# EAGLE design Adafruit Speaker Bonnet rev C (EAGLE 6.4)
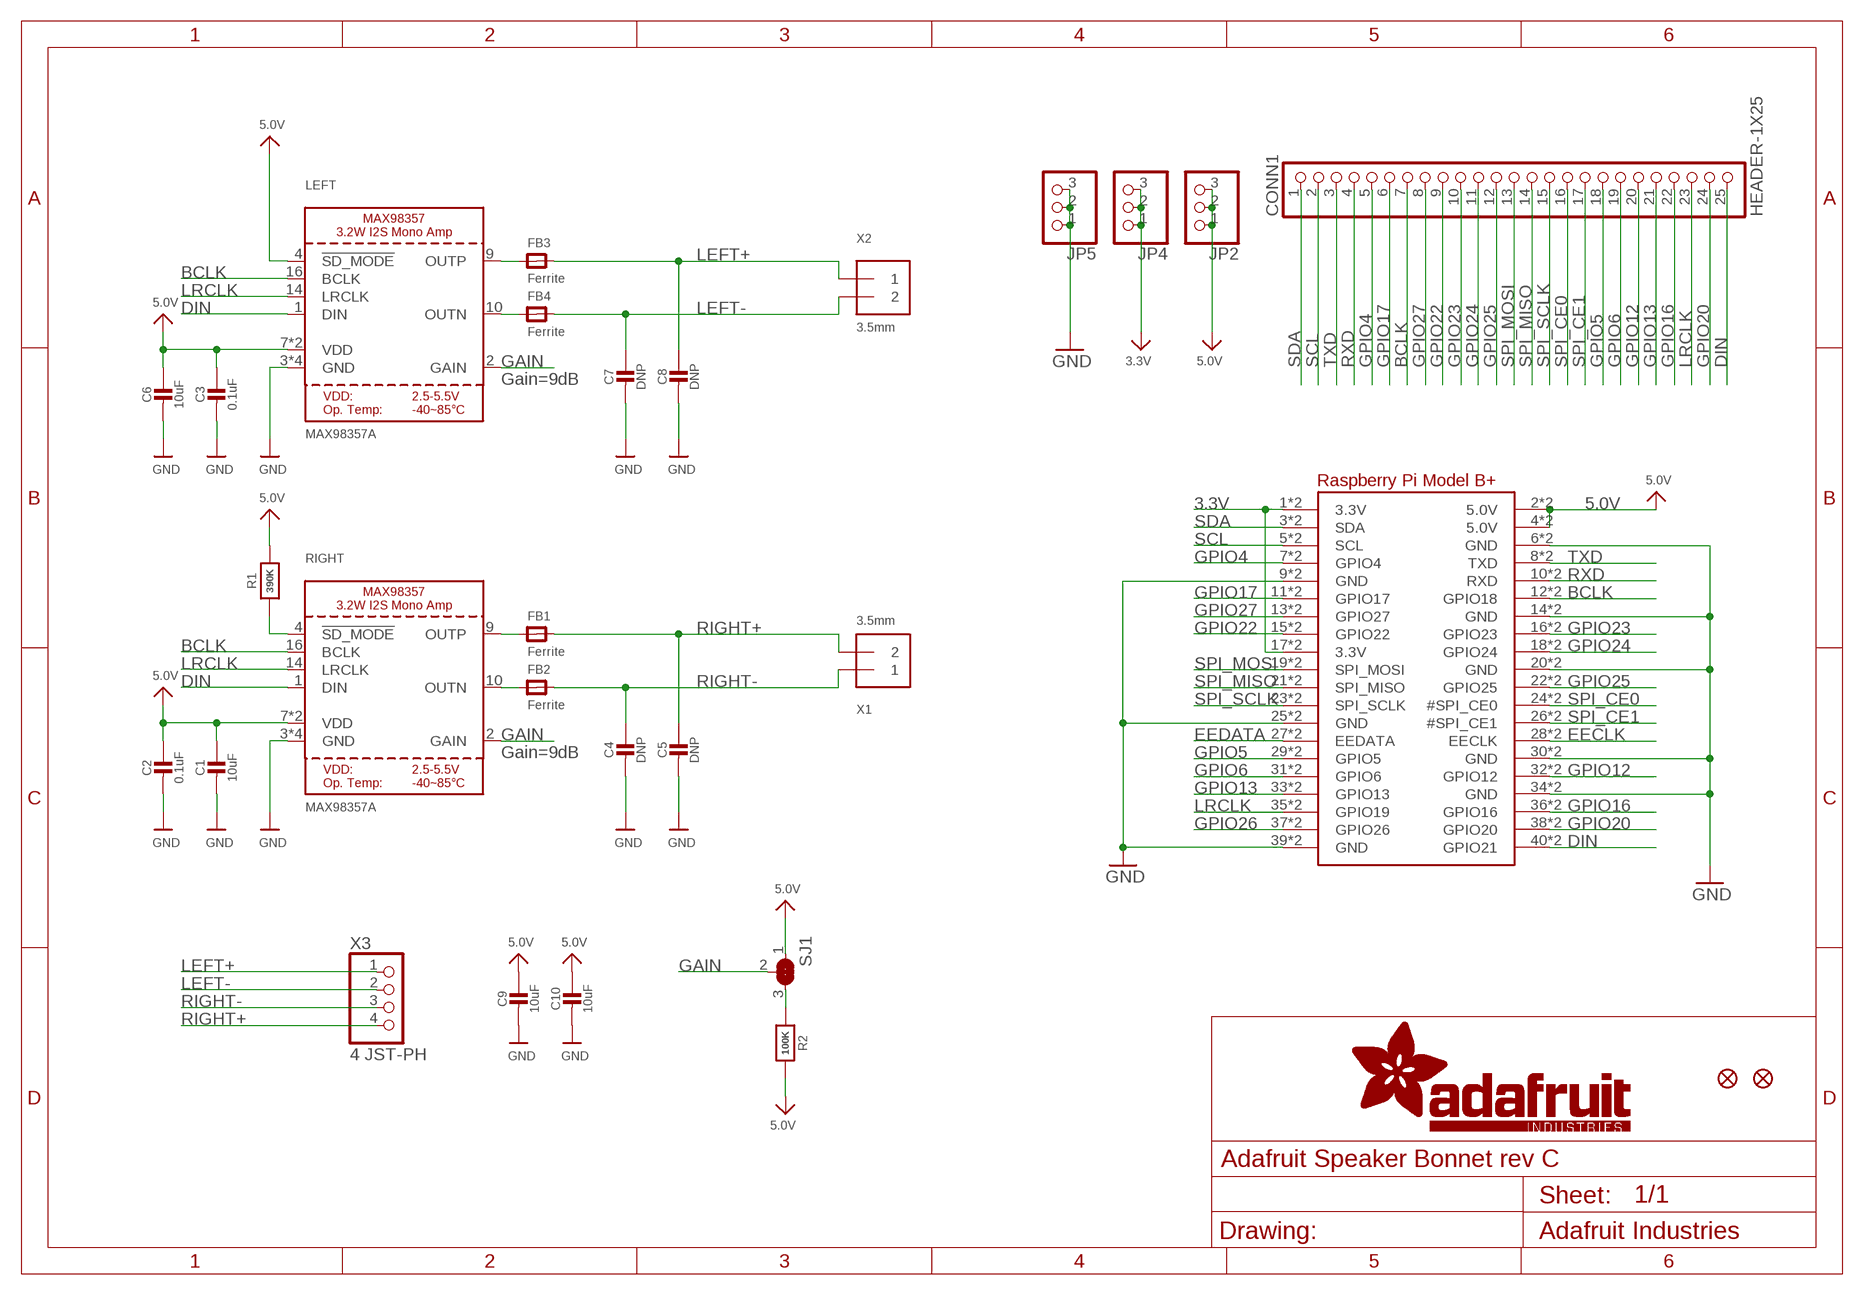
[diagram p0: schematic, sheet 1]

## Parts
C1  10uF  CAP_CERAMIC0805-NOOUTLINE  [0805-NO]
C2  0.1uF  CAP_CERAMIC0805-NOOUTLINE  [0805-NO]
C3  0.1uF  CAP_CERAMIC0805-NOOUTLINE  [0805-NO]
C4  DNP  CAP_CERAMIC0805-NOOUTLINE  [0805-NO]
C5  DNP  CAP_CERAMIC0805-NOOUTLINE  [0805-NO]
C6  10uF  CAP_CERAMIC0805-NOOUTLINE  [0805-NO]
C7  DNP  CAP_CERAMIC0805-NOOUTLINE  [0805-NO]
C8  DNP  CAP_CERAMIC0805-NOOUTLINE  [0805-NO]
C9  10uF  CAP_CERAMIC0805-NOOUTLINE  [0805-NO]
C10  10uF  CAP_CERAMIC0805-NOOUTLINE  [0805-NO]
CONN1  HEADER-1X25  [1X25_ROUND_70MIL]
FB1  Ferrite  FERRITE-0805NO  [0805-NO]
FB2  Ferrite  FERRITE-0805NO  [0805-NO]
FB3  Ferrite  FERRITE-0805NO  [0805-NO]
FB4  Ferrite  FERRITE-0805NO  [0805-NO]
FID1  FIDUCIAL_1MM  [FIDUCIAL_1MM]
FID2  FIDUCIAL_1MM  [FIDUCIAL_1MM]
JP2  HEADER-1X376MIL  [1X03_ROUND_76]
JP4  HEADER-1X376MIL  [1X03_ROUND_76]
JP5  HEADER-1X376MIL  [1X03_ROUND_76]
LEFT  MAX98357A  AUDIOAMP_MAX98357  [QFN16_3MM]
R1  390K  RESISTOR0805_NOOUTLINE  [0805-NO]
R2  100K  RESISTOR0805_NOOUTLINE  [0805-NO]
RIGHT  MAX98357A  AUDIOAMP_MAX98357  [QFN16_3MM]
RPI1  RASPBERRYPI_BPLUS_BONNET_THMSMT  [PI_BONNET_THMSMT]
SJ1  SOLDERJUMPER_2WAY  [SOLDERJUMPER_2WAY_OPEN_NOPASTE]
X1  3.5mm  TERMBLOCK_1X2  [TERMBLOCK_1X2-3.5MM]
X2  3.5mm  TERMBLOCK_1X2  [TERMBLOCK_1X2-3.5MM]
X3  4 JST-PH  CON_JST_PH_4PIN  [JSTPH4]

## Nets
3.3V: JP4.1 JP4.2 JP4.3 RPI1.1(3.3V) RPI1.17(3.3V) RPI1.S1(3.3V) RPI1.S17(3.3V)
5.0V: C1.1 C2.1 C3.1 C6.1 C9.1 C10.1 JP2.1 JP2.2 JP2.3 LEFT.4(!SD_MODE) LEFT.7(VDD) LEFT.8(VDD) R1.2 R2.2 RIGHT.7(VDD) RIGHT.8(VDD) RPI1.2(5.0V) RPI1.4(5.0V) RPI1.S2(5.0V) RPI1.S4(5.0V) SJ1.1
BCLK: CONN1.7 LEFT.16(BCLK) RIGHT.16(BCLK) RPI1.12(GPIO18) RPI1.S12(GPIO18)
DIN: CONN1.25 LEFT.1(DIN) RIGHT.1(DIN) RPI1.40(GPIO21) RPI1.S40(GPIO21)
EECLK: RPI1.28(EECLK) RPI1.S28(EECLK)
EEDATA: RPI1.27(EEDATA) RPI1.S27(EEDATA)
GAIN: LEFT.2(GAIN) RIGHT.2(GAIN) SJ1.2
GND: C1.2 C2.2 C3.2 C4.2 C5.2 C6.2 C7.2 C8.2 C9.2 C10.2 JP5.1 JP5.2 JP5.3 LEFT.3(GND) LEFT.11(GND) LEFT.15(GND) LEFT.THERMAL(GND) RIGHT.3(GND) RIGHT.11(GND) RIGHT.15(GND) RIGHT.THERMAL(GND) RPI1.6(GND) RPI1.9(GND) RPI1.14(GND) RPI1.20(GND) RPI1.25(GND) RPI1.30(GND) RPI1.34(GND) RPI1.39(GND) RPI1.S6(GND) RPI1.S9(GND) RPI1.S14(GND) RPI1.S20(GND) RPI1.S25(GND) RPI1.S30(GND) RPI1.S34(GND) RPI1.S39(GND)
GPIO4: CONN1.5 RPI1.7(GPIO4) RPI1.S7(GPIO4)
GPIO5: CONN1.18 RPI1.29(GPIO5) RPI1.S29(GPIO5)
GPIO6: CONN1.19 RPI1.31(GPIO6) RPI1.S31(GPIO6)
GPIO12: CONN1.20 RPI1.32(GPIO12) RPI1.S32(GPIO12)
GPIO13: CONN1.21 RPI1.33(GPIO13) RPI1.S33(GPIO13)
GPIO16: CONN1.22 RPI1.36(GPIO16) RPI1.S36(GPIO16)
GPIO17: CONN1.6 RPI1.11(GPIO17) RPI1.S11(GPIO17)
GPIO20: CONN1.24 RPI1.38(GPIO20) RPI1.S38(GPIO20)
GPIO22: CONN1.9 RPI1.15(GPIO22) RPI1.S15(GPIO22)
GPIO23: CONN1.10 RPI1.16(GPIO23) RPI1.S16(GPIO23)
GPIO24: CONN1.11 RPI1.18(GPIO24) RPI1.S18(GPIO24)
GPIO25: CONN1.12 RPI1.22(GPIO25) RPI1.S22(GPIO25)
GPIO26: RPI1.37(GPIO26) RPI1.S37(GPIO26)
GPIO27: CONN1.8 RPI1.13(GPIO27) RPI1.S13(GPIO27)
LEFT+: C8.1 FB3.2 X2.1 X3.1
LEFT-: C7.1 FB4.2 X2.2 X3.2
LRCLK: CONN1.23 LEFT.14(LRCLK) RIGHT.14(LRCLK) RPI1.35(GPIO19) RPI1.S35(GPIO19)
N$1: FB4.1 LEFT.10(OUTN)
N$2: FB3.1 LEFT.9(OUTP)
N$5: FB2.1 RIGHT.10(OUTN)
N$6: FB1.1 RIGHT.9(OUTP)
N$7: R2.1 SJ1.3
RIGHT+: C5.1 FB1.2 X1.2 X3.4
RIGHT-: C4.1 FB2.2 X1.1 X3.3
RXD: CONN1.4 RPI1.10(RXD) RPI1.S10(RXD)
SCL: CONN1.2 RPI1.5(SCL) RPI1.S5(SCL)
SD_MODE: R1.1 RIGHT.4(!SD_MODE)
SDA: CONN1.1 RPI1.3(SDA) RPI1.S3(SDA)
SPI_CE0: CONN1.16 RPI1.24(#SPI_CE0) RPI1.S24(#SPI_CE0)
SPI_CE1: CONN1.17 RPI1.26(#SPI_CE1) RPI1.S26(#SPI_CE1)
SPI_MISO: CONN1.14 RPI1.21(SPI_MISO) RPI1.S21(SPI_MISO)
SPI_MOSI: CONN1.13 RPI1.19(SPI_MOSI) RPI1.S19(SPI_MOSI)
SPI_SCLK: CONN1.15 RPI1.23(SPI_SCLK) RPI1.S23(SPI_SCLK)
TXD: CONN1.3 RPI1.8(TXD) RPI1.S8(TXD)

## Notes on the sheet
- Gain=9dB
- Gain=9dB

## Library data of the parts
C1-C10 = microbuilder:CAP_CERAMIC: Ceramic Capacitors For new designs, use the packages preceded by an '_' character since they are more reliable: The following footprints should be used on most boards: _0402 - Standard footprint for regular board layouts _0603 - Standard footprint for regular board layouts _0805 - Standard footprint for regular board layouts _1206 - Standard footprint for regular board layouts For extremely tight-pitch boards where space is at a premium, the following 'micro-pitch' footprints can be used (smaller pads, no silkscreen outline, etc.): _0402MP - Micro-pitch footprint for very dense/compact boards _0603MP - Micro-pitch footprint for very dense/compact boards _0805MP - Micro-pitch footprint for very dense/compact boards _1206MP - Micro-pitch footprint for very dense/compact boards
CONN1 = microbuilder:HEADER-1X25
FB1-FB4 = microbuilder:FERRITE: Ferrite Bead 0603 MMZ1608B121C - 120 Ohm @ 100MHz, 600mA, 0.15 Ohm DC Resistance - Digikey: 445-2164-1-ND BK1608HW121-T - 120 Ohm, 600mA Ferrite Chip - Digikey: 587-1876-2-ND 0805 HZ0805B272R-10 - 2.7K Ohm @ 100MHz, 200mA, 0.8 Ohm DC Resistance - Digikey: 240-2504-1-ND (see also Murata BLM21BD272SN1L) MMZ2012Y152B - 1.5K Ohm @ 100MHz, 500mA, 0.4 Ohm DC Resistance - Digikey: 445-1560-1-ND - Mainly for high frequency (80-400MHz) MMZ2012R102A - 1K Ohm @ 100MHz, 500mA, 0.3 Ohm DC Resistance - Digikey: 445-1555-2-ND - More general purpose (10-200MHz)
FID1 FID2 = microbuilder:FIDUCIAL: Fiducial Alignment Points Various fiducial points for machine vision alignment.; BOM: EXCLUDE
JP2 JP4 JP5 = microbuilder:HEADER-1X3: PIN HEADER
LEFT RIGHT = microbuilder:AUDIOAMP_MAX98357: MAX98357 - 3.2W I2S Mono Audio Amp
R1 R2 = microbuilder:RESISTOR: Resistors For new designs, use the packages preceded by an '_' character since they are more reliable: The following footprints should be used on most boards: _0402 - Standard footprint for regular board layouts _0603 - Standard footprint for regular board layouts _0805 - Standard footprint for regular board layouts _1206 - Standard footprint for regular board layouts For extremely tight-pitch boards where space is at a premium, the following 'micro-pitch' footprints can be used (smaller pads, no silkscreen outline, etc.): _0402MP - Micro-pitch footprint for very dense/compact boards _0603MP - Micro-pitch footprint for very dense/compact boards _0805MP - Micro-pitch footprint for very dense/compact boards _1206MP - Micro-pitch footprint for very dense/compact boards
RPI1 = microbuilder:RASPBERRYPI_BPLUS
SJ1 = microbuilder:SOLDERJUMPER_2WAY: 2-Way Solder Jumper
X1 X2 = microbuilder:TERMBLOCK_1X2: 3.5mm Terminal block http://www.ladyada.net/library/pcb/eaglelibrary.html
X3 = microbuilder:CON_JST_PH_4PIN: JST 4-Pin Right-Angle Connector 4UConnector: 17312

## Board
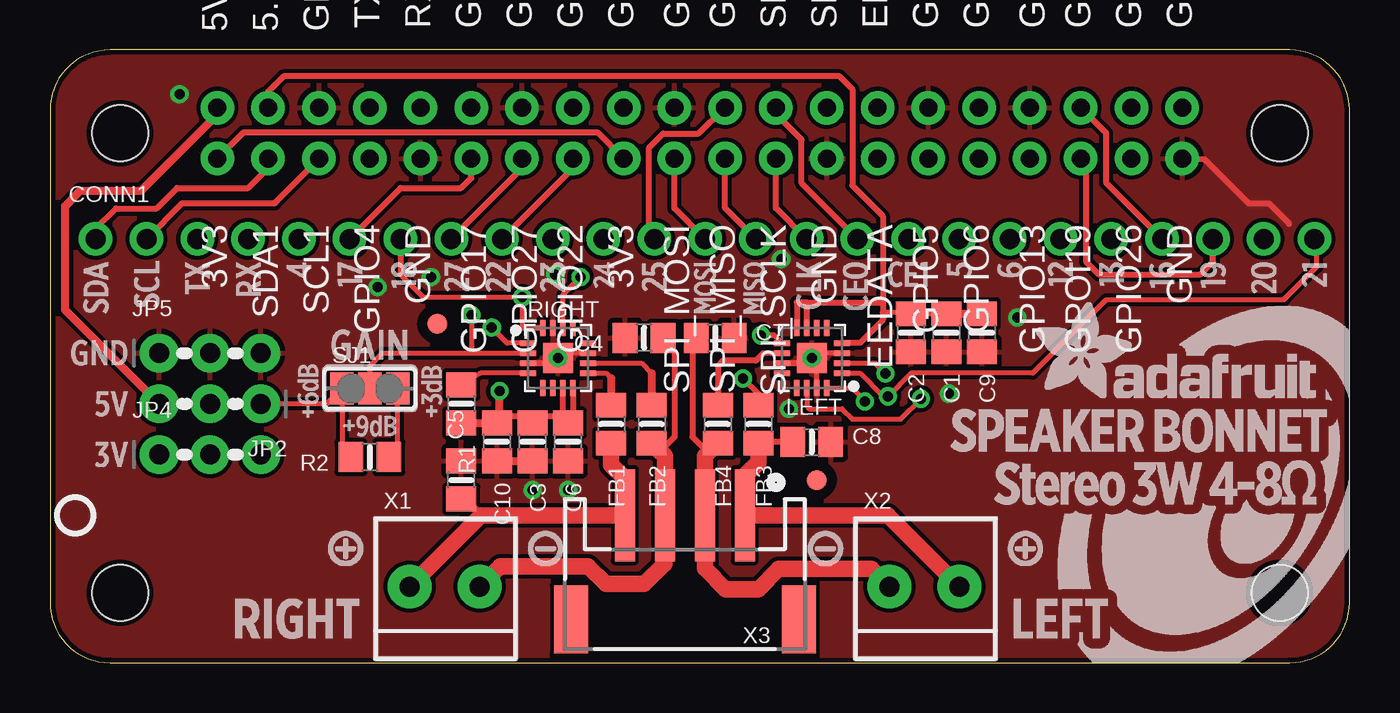
[diagram p1: board, top side]
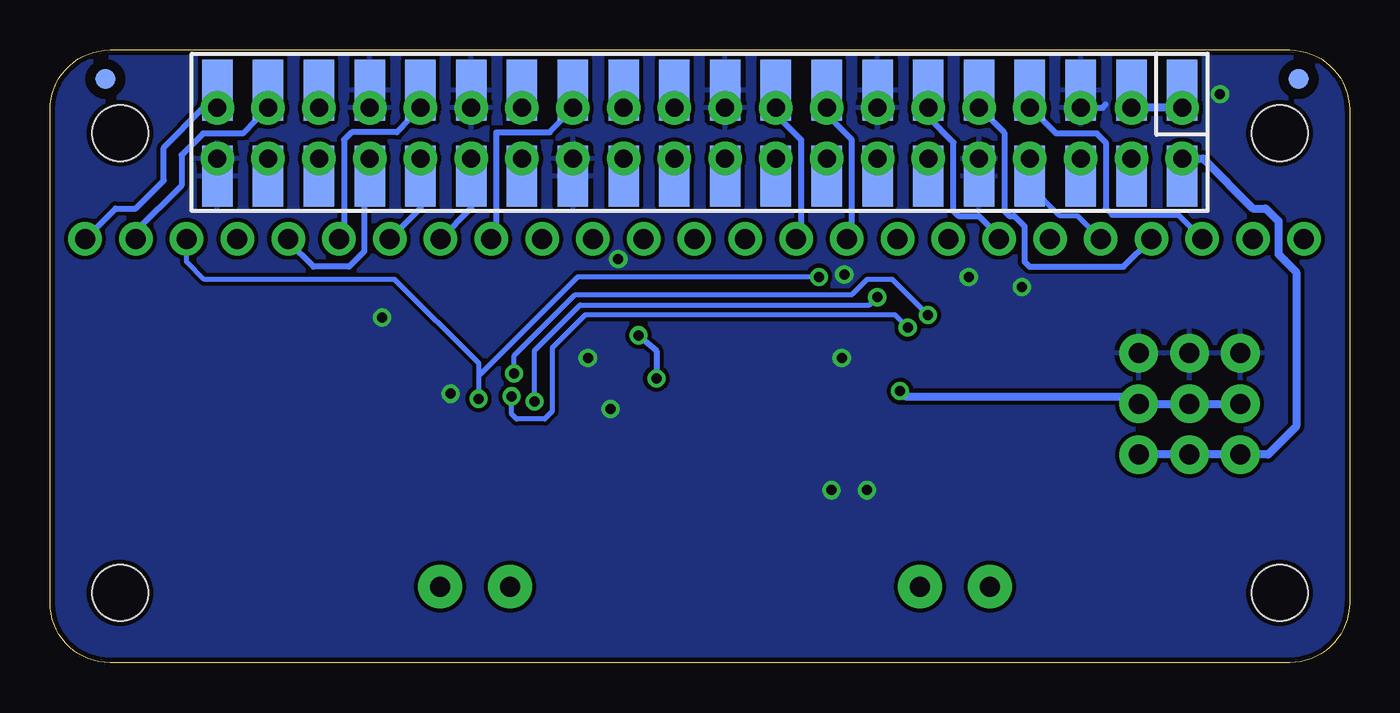
[diagram p2: board, bottom side, seen from below]

Size 65 x 30.66 mm. Coordinates in mm from the lower left corner, seen from the top.
Copper layers (1*16): Top 0.035mm / dielectric 1.5mm / Bottom 0.035mm
Design rules "adafruit": minimum track width 8mil, minimum drill 15.5mil, track to track 8mil, track to pad 8mil, pad to pad 8mil, via to via 8mil, smd to smd 8mil, copper to edge 10mil, drill to drill 8mil, minimum pad ring 10mil, minimum via ring 8mil, stop-mask expansion 2mil, vias tented up to drill 20mil, thermal gap 10mil

### Footprints (pad centres in the part's own frame; a part is rotated, then mirrored left to right if it is on the bottom)
0805-NO = smd 1.24 x 1.5: 1 -0.95,0; 2 0.95,0
1X25_ROUND_70MIL = drill 1 pad 1.676: 1 -30.48,0; 2 -27.94,0; 3 -25.4,0; 4 -22.86,0; 5 -20.32,0; 6 -17.78,0; 7 -15.24,0; 8 -12.7,0; 9 -10.16,0; 10 -7.62,0; 11 -5.08,0; 12 -2.54,0; 13 0,0; 14 2.54,0; 15 5.08,0; 16 7.62,0; 17 10.16,0; 18 12.7,0; 19 15.24,0; 20 17.78,0; 21 20.32,0; 22 22.86,0; 23 25.4,0; 24 27.94,0; 25 30.48,0
FIDUCIAL_1MM = smd 1 x 1: 1 0,0
1X03_ROUND_76 = drill 1 pad 1.93: 1 -2.54,0; 2 0,0; 3 2.54,0
QFN16_3MM = smd 0.8 x 0.28: 1 -1.5,0.75; 2 -1.5,0.25; 3 -1.5,-0.25; 4 -1.5,-0.75; 9 1.5,-0.75; 10 1.5,-0.25; 11 1.5,0.25; 12 1.5,0.75 | smd 0.28 x 0.8: 5 -0.75,-1.5; 6 -0.25,-1.5; 7 0.25,-1.5; 8 0.75,-1.5; 13 0.75,1.5; 14 0.25,1.5; 15 -0.25,1.5; 16 -0.75,1.5 | smd 1.5 x 1.5: THERMAL 0,0
PI_BONNET_THMSMT = drill 0.9 pad 1.676: 1 8.37,25.23; 2 8.37,27.77; 3 10.91,25.23; 4 10.91,27.77; 5 13.45,25.23; 6 13.45,27.77; 7 15.99,25.23; 8 15.99,27.77; 9 18.53,25.23; 10 18.53,27.77; 11 21.07,25.23; 12 21.07,27.77; 13 23.61,25.23; 14 23.61,27.77; 15 26.15,25.23; 16 26.15,27.77; 17 28.69,25.23; 18 28.69,27.77; 19 31.23,25.23; 20 31.23,27.77; 21 33.77,25.23; 22 33.77,27.77; 23 36.31,25.23; 24 36.31,27.77; 25 38.85,25.23; 26 38.85,27.77; 27 41.39,25.23; 28 41.39,27.77; 29 43.93,25.23; 30 43.93,27.77; 31 46.47,25.23; 32 46.47,27.77; 33 49.01,25.23; 34 49.01,27.77; 35 51.55,25.23; 36 51.55,27.77; 37 54.09,25.23; 38 54.09,27.77; 39 56.63,25.23; 40 56.63,27.77 | smd 1 x 1 bottom: 41 2.54,29.21; 42 62.23,29.21 | smd 1.524 x 3.048 bottom: S1 8.37,24.339; S2 8.37,28.657; S3 10.91,24.339; S4 10.91,28.657; S5 13.45,24.339; S6 13.45,28.657; S7 15.99,24.339; S8 15.99,28.657; S9 18.53,24.339; S10 18.53,28.657; S11 21.07,24.339; S12 21.07,28.657; S13 23.61,24.339; S14 23.61,28.657; S15 26.15,24.339; S16 26.15,28.657; S17 28.69,24.339; S18 28.69,28.657; S19 31.23,24.339; S20 31.23,28.657; S21 33.77,24.339; S22 33.77,28.657; S23 36.31,24.339; S24 36.31,28.657; S25 38.85,24.339; S26 38.85,28.657; S27 41.39,24.339; S28 41.39,28.657; S29 43.93,24.339; S30 43.93,28.657; S31 46.47,24.339; S32 46.47,28.657; S33 49.01,24.339; S34 49.01,28.657; S35 51.55,24.339; S36 51.55,28.657; S37 54.09,24.339; S38 54.09,28.657; S39 56.63,24.339; S40 56.63,28.657 | hole 2.8: 3.5,26.5; 61.5,26.5; 61.5,3.5; 3.5,3.5
SOLDERJUMPER_2WAY_OPEN_NOPASTE = smd 1.168 x 1.6: 1 -1.397,0; 2 0,0; 3 1.397,0
TERMBLOCK_1X2-3.5MM = drill 1 pad 2.184: 1 1.8,0; 2 -1.7,0
JSTPH4 = smd 1 x 4.6: 1 -3,-3.7; 2 -1,-3.7; 3 1,-3.7; 4 3,-3.7 | smd 1.7 x 3.4: NC1 -5.7,1.5; NC2 5.7,1.5

### Placement (x,y rotation side)
C1  44.83,16.51 270 top
C2  43.05,16.51 270 top
C3  24.13,11.05 270 top
C4  29.72,16.26 180 top
C5  20.57,9.14 90 top
C6  25.91,11.05 270 top
C7  33.27,16.26 0 top
C8  38.1,11.05 0 top
C9  46.61,16.51 270 top
C10  22.35,11.05 270 top
CONN1  32.77,21.21 0 top
FB1  28.07,11.94 270 top
FB2  30.1,11.94 270 top
FB3  35.43,11.94 270 top
FB4  33.4,11.94 270 top
FID1  19.37,16.95 0 top
FID2  38.35,9.14 0 top
JP2  8,12.95 180 top
JP4  8,10.41 0 top
JP5  8,15.49 0 top
LEFT  38.1,15.24 180 top
R1  20.57,12.95 270 top
R2  16,10.29 180 top
RIGHT  25.4,15.24 0 top
RPI1  0,0 0 top
SJ1  16,13.72 0 top
U$11  [PCBFEAT-REV-040]  1.27,7.37 0 top
U$30  [BONNET_SPEAKER_REVB]  0,0 0 top
X1  19.68,3.81 0 top
X2  43.69,3.81 0 top
X3  31.75,3.68 180 top

### Tracks (layer width: path | path; a pad name or v marks a point on that pad's centre or on a via)
3.3V
  Top 0.305: RPI1.1 9.68,26.54 27.38,26.54 RPI1.17
  Bottom 0.406: RPI1.1 8.37,25.73 | 28.69,25.54 RPI1.17 RPI1.S17 | JP4.3 JP4.2 JP4.1 4.06,10.41 2.67,11.81 2.67,19.56 3.56,20.45 3.56,22.1 4.19,22.73 4.83,22.73 7.32,25.23 RPI1.1 | RPI1.1 | RPI1.1 RPI1.S1 | RPI1.S17
5.0V  (via drill 0.5)
  Top 0.254: C3.1 24.38,12.25 24.38,12.32 | C6.1 25.91,12.32 | C1.1 C2.1 42.99,17.53 41.66,17.53 | R1.2 20.51,12.06 | R2.2 14.61,10.73 SJ1.1 13.84,12.95 JP2.1
  Top 0.305: RPI1.4 10.91,28.56 11.68,29.34 39.5,29.34 40.13,28.7 40.13,23.88 41.66,22.35 41.66,18.03 | 41.66,18.03 41.66,17.53 41.66,17.14 40.51,16 39.61,16 LEFT.4 | LEFT.7 37.85,18.03 | 37.85,18.03 37.35,18.03 LEFT.8 | 37.85,18.03 41.66,18.03 | RIGHT.8 26.15,12.32 25.91,12.32 25.65,12.32 | 25.65,12.32 RIGHT.7 | 25.65,12.32 24.38,12.32 22.99,12.32
  Top 0.406: C9.1 C1.1 | R1.2 C10.1 | C10.1 22.48,12.13 v22.48,13.59 | 22.99,12.32 22.67,12 C10.1 | JP2.3 0.76,17.65 0.76,22.86 1.52,23.62 4.57,23.62 8.37,27.42 RPI1.2
  Bottom 0.305: RPI1.4 10.29,27.77 9.78,27.77
  Bottom 0.406: v22.48,13.59 22.23,13.34 10.92,13.34 JP2.1 JP2.2 JP2.3 | RPI1.2 10.29,27.77 | RPI1.2 | RPI1.2 RPI1.S2 | RPI1.S4 | RPI1.S4 RPI1.4
BCLK  (via drill 0.5)
  Top 0.254: LEFT.16 40.11,13.74 v40.77,13.08 | 23.62,16.76 v23.62,18.29 18.67,18.29 17.53,19.43
  Top 0.305: CONN1.7 17.53,19.43 | 23.62,16.76 24.63,16.76 RIGHT.16
  Bottom 0.254: v40.77,13.08 40.77,15.62 38.48,17.91 24,17.91 v23.62,18.29
  Bottom 0.305: RPI1.12 21.07,27.29 19.81,26.04 19.81,22.61 19.56,22.35 18.54,22.35 18.03,21.84 18.03,21.72 CONN1.7
  Bottom 0.406: RPI1.S12 | RPI1.S12 RPI1.12
DIN  (via drill 0.5)
  Top 0.254: CONN1.25 63.37,21.08 63.37,19.81 61.72,18.16 52.83,18.16 49.16,14.49 43.06,14.49 v41.91,13.34 41.66,13.34 40.5,14.49 LEFT.1 | RIGHT.1 22.87,15.99 v22.1,16.76
  Bottom 0.254: v22.1,16.76 22.73,17.4 38.23,17.4 39.88,15.75 39.88,12.57 40.26,12.19 41.66,12.19 41.91,12.45 v41.91,13.34 | 56.68,27.69 56.63,27.73 RPI1.40
  Bottom 0.305: CONN1.25 61.72,22.73 60.71,22.73 59.31,24.13 59.31,25.78 57.4,27.69 56.68,27.69
  Bottom 0.406: RPI1.S40 | RPI1.S40 RPI1.40
EECLK
  Bottom 0.406: RPI1.S28 | RPI1.S28 RPI1.28
EEDATA
  Bottom 0.406: RPI1.S27 | RPI1.S27 RPI1.27
GAIN  (via drill 0.5)
  Top 0.254: LEFT.2 41.27,14.99 v41.78,14.48 | SJ1.2 16,14.86 16.63,15.49 21.08,15.49 | 21.08,15.49 RIGHT.2 | v21.08,17.4 21.08,15.49
  Bottom 0.254: v41.78,14.48 41.78,15.37 38.73,18.41 24.89,18.41 24.13,19.18 22.86,19.18 v21.08,17.4
GND  (via drill 0.5)
  Top 0.254: LEFT.15 38.35,14.99 LEFT.THERMAL 38.35,15.49 LEFT.3 | RIGHT.11 25.65,15.49 RIGHT.THERMAL
  Top 0.305: 61.98,21.97 60.96,22.99 59.94,22.99 57.74,25.2 RPI1.39 | RIGHT.3 25.4,14.99 RIGHT.THERMAL | LEFT.11 38.1,14.99 LEFT.THERMAL
  Top 0.406: 22.6,10.1 C3.2
  Bottom 0.305: RPI1.6 12.36,27.77 12.19,27.94
  other vias: 24.13,8.64 25.91,8.64 25.4,15.24 38.1,15.24 36.96,12.7 19.05,19.3 16.38,18.8 48.39,17.27 44.96,13.46 25.27,19.43 36.58,20.19 6.48,28.45
  pour Top: 0,30.73 0,0 65.02,0 65.02,30.73
  pour Bottom: 0,30.73 0,0 65.02,0 65.02,30.73
GPIO4
  Bottom 0.254: CONN1.5 13.59,22.35 14.48,22.35 15.99,23.86 RPI1.7
  Bottom 0.406: RPI1.S7 | RPI1.S7 RPI1.7
GPIO5
  Bottom 0.305: RPI1.29 43.93,24.13 43.93,22.75 CONN1.18
  Bottom 0.406: RPI1.S29 | RPI1.S29 43.93,24.13
GPIO6
  Bottom 0.305: RPI1.31 46.47,24.64 46.47,22.75 CONN1.19
  Bottom 0.406: RPI1.S31 | RPI1.S31 46.47,24.64
GPIO12
  Bottom 0.305: RPI1.32 47.62,26.58 47.66,26.54 49.91,26.54 50.29,26.16 50.29,21.46 CONN1.20 50.55,21.34
  Bottom 0.406: RPI1.S32 | RPI1.S32 RPI1.32
GPIO13
  Bottom 0.305: RPI1.33 49.1,25.2 49.1,24.05 49.28,23.88 49.28,20.57 50.04,19.81 51.82,19.81 53.09,21.08 CONN1.21
  Bottom 0.406: 49.1,24.05 49.02,24.05 49.02,24.89 49.01,24.89 RPI1.S33
GPIO16
  Top 0.305: CONN1.22 52.83,24 52.83,26.49 RPI1.36
  Bottom 0.305: RPI1.36 51.55,27.42
  Bottom 0.406: RPI1.S36 | RPI1.S36 RPI1.36
GPIO17
  Top 0.305: CONN1.6 17.53,23.75 20.57,23.75 21.07,24.25 RPI1.11
  Bottom 0.406: RPI1.S11 | RPI1.S11 RPI1.11
GPIO20
  Bottom 0.305: RPI1.38 55.35,26.48 57.34,26.48 58.42,25.4 58.42,23.88 60.71,21.59 CONN1.24
  Bottom 0.406: RPI1.S38 | RPI1.S38 RPI1.38
GPIO22
  Top 0.305: CONN1.9 26.15,24.75 RPI1.15
  Bottom 0.406: RPI1.S15 | RPI1.S15 RPI1.15
GPIO23
  Bottom 0.305: CONN1.10 24.89,21.46 24.89,26.16 26.15,27.42 RPI1.16
  Bottom 0.406: RPI1.S16 | RPI1.S16 RPI1.16
GPIO24
  Bottom 0.305: RPI1.18 28.69,27.42 27.43,26.16 27.43,21.46 CONN1.11
  Bottom 0.406: RPI1.S18 | RPI1.S18 RPI1.18
GPIO25
  Top 0.305: CONN1.12 29.97,21.46 29.97,25.78 30.67,26.48 32.45,26.48 33.7,27.73 RPI1.22
  Bottom 0.406: RPI1.S22 | RPI1.S22 RPI1.22
GPIO26
  Bottom 0.406: RPI1.S37 | RPI1.S37 RPI1.37
GPIO27
  Top 0.305: CONN1.8 23.61,24.75 RPI1.13
  Bottom 0.406: RPI1.S13 | RPI1.S13 RPI1.13
LEFT+
  Top 0.305: C8.1 35.49,11.05 FB3.2
  Top 0.813: X2.1 41.91,7.38 X3.1 34.8,7.43 34.8,9.4 35.43,10.03 FB3.2
LEFT-
  Top 0.305: C7.1 32.13,16.2 32.13,11.3 32.75,10.68 32.75,10.34
  Top 0.813: X2.2 41.1,4.7 36.45,4.7 35.43,3.68 33.78,3.68 32.75,4.71 X3.2 32.75,10.34 FB4.2
LRCLK  (via drill 0.5)
  Top 0.254: LEFT.14 37.85,12.82 37.97,12.7 39.62,12.7 40.13,12.19 42.55,12.19 v43.56,13.21 | RIGHT.14 25.65,18.41 v26.54,19.3
  Top 0.305: RPI1.35 51.82,24.96 51.82,20.07 52.45,19.43 57.53,19.43 58.17,20.07 CONN1.23
  Bottom 0.254: CONN1.23 58.17,20.07 57.28,19.18 47.75,19.18 43.56,14.99 43.56,14.35 | v26.54,19.3 38.61,19.3 43.56,14.35 | 43.56,14.35 v43.56,13.21
  Bottom 0.406: RPI1.S35 | RPI1.S35 RPI1.35
N$1
  Top 0.254: 35.68,15.49 LEFT.10
  Top 0.305: FB4.1 33.4,14.86 33.66,15.11 35.31,15.11 35.68,15.49
N$2  (via drill 0.5)
  Top 0.254: LEFT.9 36.21,16.38
  Top 0.305: 34.8,13.97 v34.67,14.22 35.43,13.46 FB3.1 | 36.21,16.38 v35.56,16.38
  Bottom 0.305: v35.56,16.38 34.67,15.62 v34.67,14.22
N$4
  Top 0.254: 15.88,13.72 14.73,13.72
N$5
  Top 0.254: RIGHT.10 29.59,14.99 30.1,14.48
  Top 0.406: 30.1,14.48 FB2.1
N$6
  Top 0.254: RIGHT.9 27.8,14.49 28.07,14.22
  Top 0.406: 28.07,14.22 FB1.1
N$7
  Top 0.254: R2.1 17.4,10.73 SJ1.3
RIGHT+
  Top 0.406: C5.1 21.59,7.42 21.56,7.38
  Top 0.813: X1.2 21.56,7.38 X3.4 28.7,7.43 28.7,9.27 28.07,9.91 FB1.2
RIGHT-
  Top 0.305: C4.1 31.24,15.55 31.24,11.3 30.58,10.64 30.45,10.64
  Top 0.813: X1.1 22.5,4.83 26.92,4.83 27.81,3.94 29.72,3.94 30.73,4.95 30.73,7.37 X3.3 30.75,10.34 30.45,10.64 FB2.2
RXD
  Bottom 0.305: RPI1.10 17.27,26.51 17.27,22.61 17.02,22.35 16.76,22.35 16.26,21.84 16.26,20.07 16,19.81 11.3,19.81 CONN1.4
  Bottom 0.406: RPI1.S10 | RPI1.S10 RPI1.10
SCL
  Top 0.305: CONN1.2 6.6,22.99 11.24,22.99 RPI1.5
  Bottom 0.406: RPI1.S5 | RPI1.S5 RPI1.5
SD_MODE
  Top 0.254: RIGHT.4 21.54,14.49 R1.1
SDA
  Top 0.305: CONN1.1 2.29,21.72 3.3,22.73 5.33,22.73 6.35,23.75 9.91,23.75 10.91,24.75 RPI1.3
  Bottom 0.406: RPI1.S3 | RPI1.S3 RPI1.3
SPI_CE0
  Top 0.305: CONN1.16 37.59,24 37.59,26.16 36.31,27.44 RPI1.24
  Bottom 0.406: RPI1.S24 | RPI1.S24 RPI1.24
SPI_CE1
  Bottom 0.305: 38.85,27.7 38.85,27.57 | CONN1.17 42.67,21.46 42.67,26.54 40.01,26.54 38.85,27.7 | 38.85,27.7 RPI1.26
  Bottom 0.406: RPI1.S26 | RPI1.S26 RPI1.26
SPI_MISO
  Top 0.305: CONN1.14 33.77,22.75 RPI1.21
  Bottom 0.406: RPI1.S21 | RPI1.S21 RPI1.21
SPI_MOSI
  Top 0.305: CONN1.13 31.23,22.75 RPI1.19
  Bottom 0.406: RPI1.S19 | RPI1.S19 RPI1.19
SPI_SCLK
  Top 0.305: CONN1.15 36.31,22.75 RPI1.23
  Bottom 0.406: RPI1.S23 | RPI1.S23 RPI1.23
TXD
  Bottom 0.305: RPI1.8 15.92,27.73 14.67,26.48 12.64,26.48 12.19,26.04 12.19,22.73 11.87,22.42 8.57,22.42 CONN1.3
  Bottom 0.406: RPI1.S8 | RPI1.S8 RPI1.8